# EAGLE design panel2 (EAGLE 7.7.0)
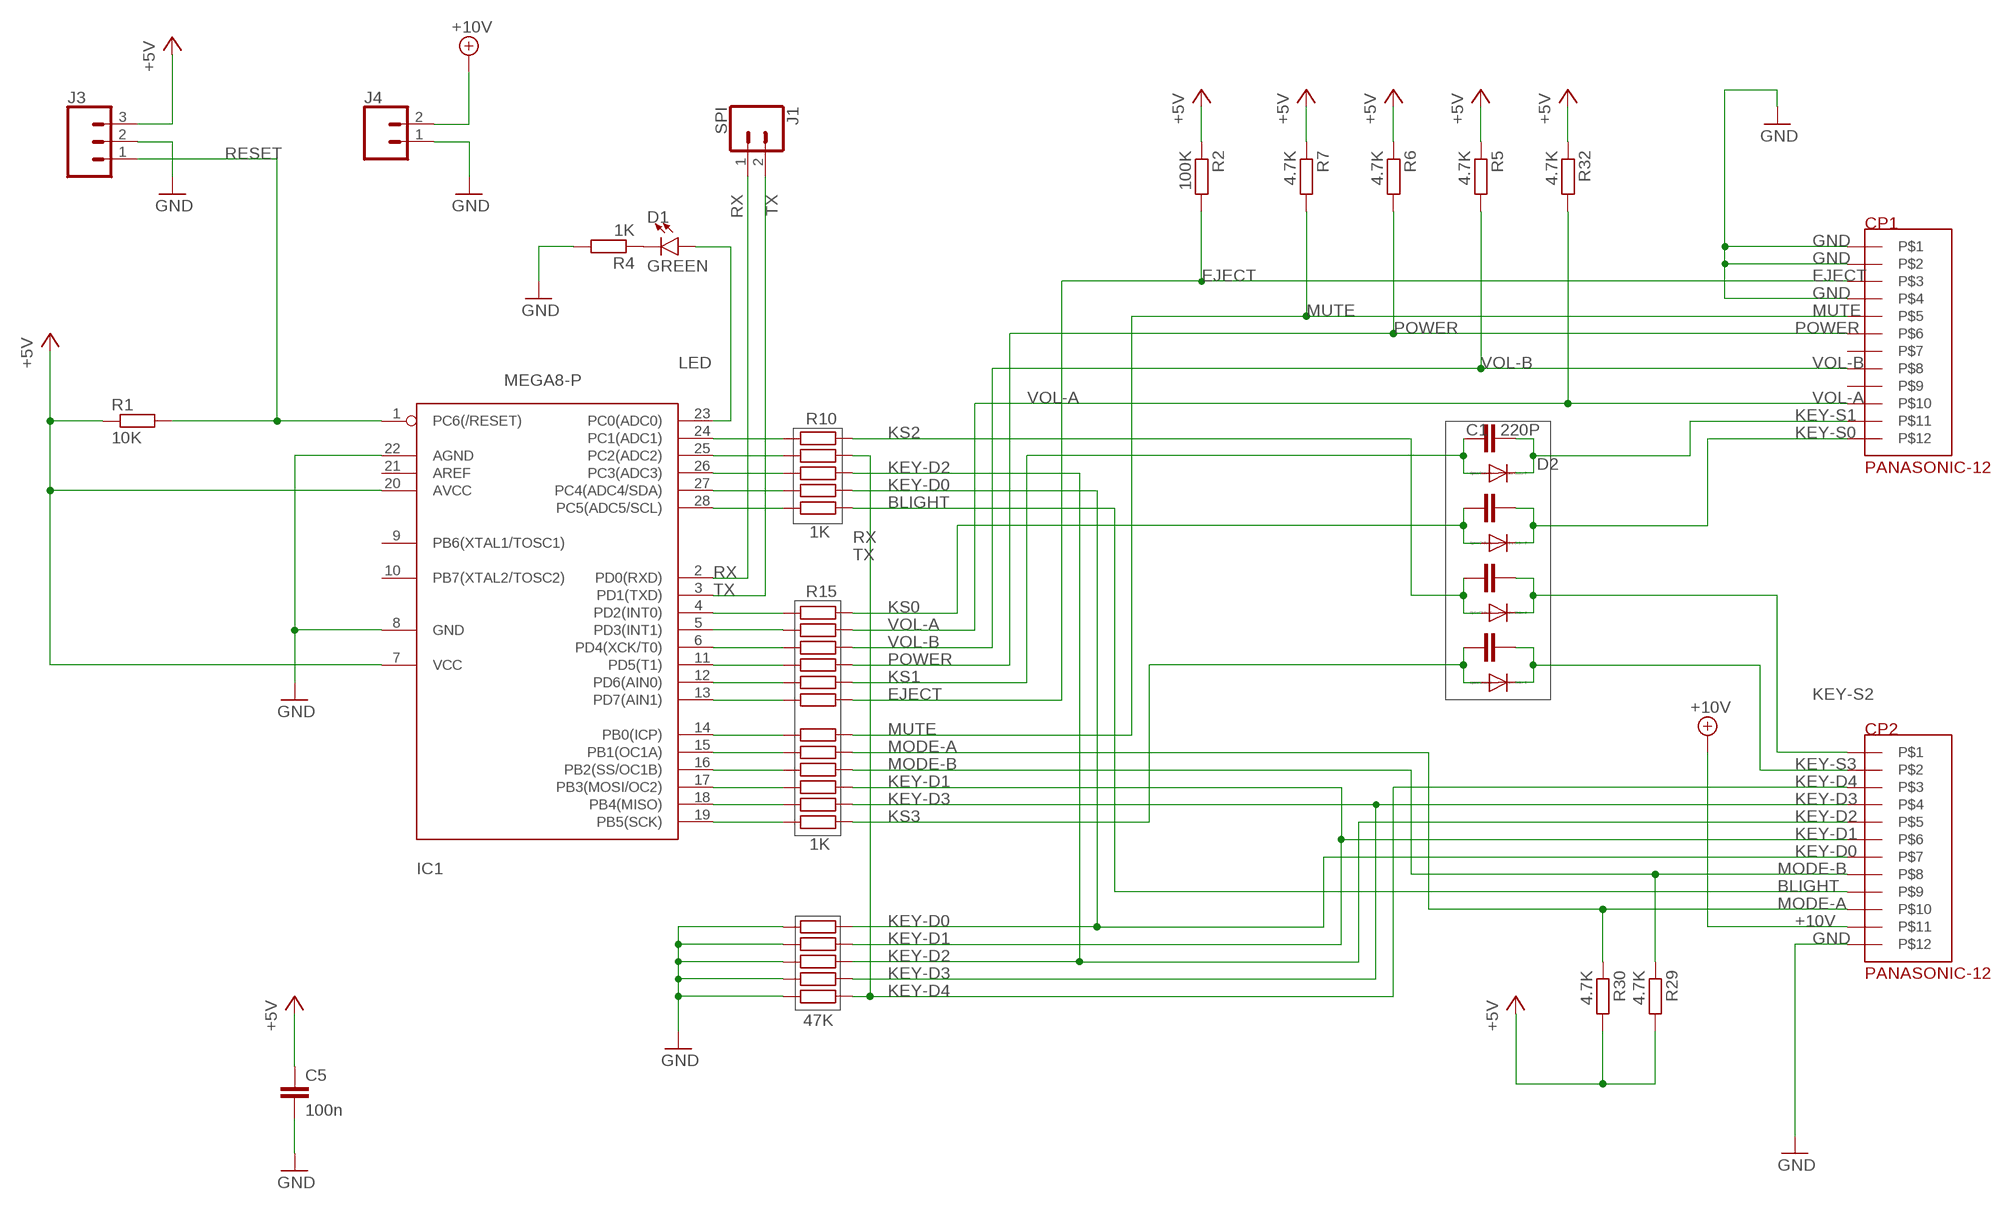
[diagram p0: schematic, sheet 1]

## Parts
C1  220P  C-EUC0805  [C0805]
C2  220P  C-EUC0805  [C0805]
C3  220P  C-EUC0805  [C0805]
C4  220P  C-EUC0805  [C0805]
C5  100n  C-EUC0805  [C0805]
CP1  PANASONIC-12  [PANASONIC-12]
CP2  PANASONIC-12  [PANASONIC-12]
D1  GREEN  LED-GREEN1206  [LED-1206]
D2  1N4148DO35-10  [DO35-10]
D3  1N4148DO35-10  [DO35-10]
D4  1N4148DO35-10  [DO35-10]
D5  1N4148DO35-10  [DO35-10]
IC1  MEGA8-P  [DIL28-3]
J1  SPI  CONN_02PTH3  [1X02_LONGPADS]
J3  CONN_03LONGPADS  [1X03_LONGPADS]
J4  CONN_02LOCK_LONGPADS  [1X02_LOCK_LONGPADS]
R1  10K  R-EU_M0805  [M0805]
R2  100K  R-EU_M0805  [M0805]
R3  47K  R-EU_0207/10  [0207/10]
R4  1K  R-EU_M0805  [M0805]
R5  4.7K  R-EU_M0805  [M0805]
R6  4.7K  R-EU_M0805  [M0805]
R7  4.7K  R-EU_M0805  [M0805]
R8  1K  R-EU_M0805  [M0805]
R9  1K  R-EU_M0805  [M0805]
R10  1K  R-EU_M0805  [M0805]
R11  1K  R-EU_M0805  [M0805]
R12  1K  R-EU_M0805  [M0805]
R13  1K  R-EU_M0805  [M0805]
R14  1K  R-EU_M0805  [M0805]
R15  1K  R-EU_M0805  [M0805]
R16  1K  R-EU_M0805  [M0805]
R17  1K  R-EU_M0805  [M0805]
R18  1K  R-EU_M0805  [M0805]
R19  1K  R-EU_M0805  [M0805]
R20  1K  R-EU_M0805  [M0805]
R21  1K  R-EU_M0805  [M0805]
R22  1K  R-EU_M0805  [M0805]
R23  1K  R-EU_M0805  [M0805]
R24  47K  R-EU_0207/10  [0207/10]
R25  47K  R-EU_0207/10  [0207/10]
R28  47K  R-EU_0207/10  [0207/10]
R29  4.7K  R-EU_M0805  [M0805]
R30  4.7K  R-EU_M0805  [M0805]
R31  1K  R-EU_M0805  [M0805]
R32  4.7K  R-EU_0207/10  [0207/10]
R34  47K  R-EU_0207/10  [0207/10]

## Nets
+5V: C5.1 IC1.7(VCC) IC1.20(AVCC) J3.3 R1.1 R2.1 R5.1 R6.1 R7.1 R29.2 R30.2 R32.1
+10V: CP2.P11 J4.2
BLIGHT: CP2.P9 R14.2
EJECT: CP1.P3 R2.2 R23.2
GND: C5.2 CP1.P1 CP1.P2 CP1.P4 CP2.P12 IC1.8(GND) IC1.22(AGND) J3.2 J4.1 R3.2 R4.2 R24.2 R25.2 R28.2 R34.2
KEY-D0: CP2.P7 R13.2 R24.1
KEY-D1: CP2.P6 R18.2 R25.1
KEY-D2: CP2.P5 R12.2 R28.1
KEY-D3: CP2.P4 R21.2 R34.1
KEY-D4: CP2.P3 R3.1 R11.2
KEY-S0: C2.2 CP1.P12 D3.C
KEY-S1: C1.2 CP1.P11 D2.C
KEY-S2: C3.2 CP2.P1 D4.C
KEY-S3: C4.2 CP2.P2 D5.C
KS0: C2.1 D3.A R15.2
KS1: C1.1 D2.A R22.2
KS2: C3.1 D4.A R10.2
KS3: C4.1 D5.A R31.2
LED: D1.A IC1.23(PC0(ADC0))
MODE-A: CP2.P10 R20.2 R30.1
MODE-B: CP2.P8 R17.2 R29.1
MUTE: CP1.P5 R7.2 R19.2
N$3: D1.C R4.1
N$4: IC1.4(PD2(INT0)) R15.1
N$5: IC1.24(PC1(ADC1)) R10.1
N$6: IC1.25(PC2(ADC2)) R11.1
N$7: IC1.26(PC3(ADC3)) R12.1
N$8: IC1.27(PC4(ADC4/SDA)) R13.1
N$9: IC1.28(PC5(ADC5/SCL)) R14.1
N$10: IC1.5(PD3(INT1)) R16.1
N$11: IC1.6(PD4(XCK/T0)) R8.1
N$12: IC1.11(PD5(T1)) R9.1
N$19: IC1.19(PB5(SCK)) R31.1
N$20: IC1.18(PB4(MISO)) R21.1
N$21: IC1.17(PB3(MOSI/OC2)) R18.1
N$22: IC1.16(PB2(SS/OC1B)) R17.1
N$23: IC1.15(PB1(OC1A)) R20.1
N$24: IC1.14(PB0(ICP)) R19.1
N$25: IC1.12(PD6(AIN0)) R22.1
N$26: IC1.13(PD7(AIN1)) R23.1
POWER: CP1.P6 R6.2 R9.2
RESET: IC1.1(PC6(/RESET)) J3.1 R1.2
RX: IC1.2(PD0(RXD)) J1.1
TX: IC1.3(PD1(TXD)) J1.2
VOL-A: CP1.P10 R16.2 R32.2
VOL-B: CP1.P8 R5.2 R8.2
Unconnected: CP1.P7 CP1.P9 IC1.9(PB6(XTAL1/TOSC1)) IC1.10(PB7(XTAL2/TOSC2)) IC1.21(AREF)

## Library data of the parts
C1-C5 = rcl:C-EU: CAPACITOR, European symbol
CP1 CP2 = Connectors:PANASONIC-12
D1 = SparkFun-LED:LED-GREEN: Green SMD LED Used in manufacturing of various products at SparkFun Packages: 0603 - SMD 0603 package [Product Link] <http://www.futureelectronics.com/en/technologies/semiconductors/optoelectronics/leds/Pages/9894312-LTST-C190GKT.aspx?CrossPart=HSMG-C190&IM=0> LilyPad 1206 - SMD1206 LilyPad package [Product Link] <http://www.futureelectronics.com/en/Technologies/Product.aspx?ProductID=IN150NGHARVATEKCORPORATION2049943&IM=0> 1206 - SMD1206 package [Product Link] <http://www.futureelectronics.com/en/technologies/semiconductors/optoelectronics/leds/Pages/8315665-LTST-C150KGKT.aspx?IM=0> 1206 Bottom Mount -SMD 1206 Bottom Mount [Product Link] <http://www.digikey.com/product-detail/en/lite-on-inc/LTST-C230KGKT/160-1456-1-ND/386854> SparkFun Products: Pro Mini 328 -5V <https://www.sparkfun.com/products/821> RedBoard <https://www.sparkfun.com/products/12757> MP3 Trigger <https://www.sparkfun.com/products/13720> Makey Makey <https://www.sparkfun.com/products/11076>; PROD_ID: DIO-00862
D2-D5 = diode:1N4148: DIODE high speed (Philips)
IC1 = avr:MEGA8-P: MICROCONTROLLER 8 Kbytes FLASH 1 kbytes SRAM 512 bytes EEPROM USART 4-channel 10 bit ADC 2-channel 8 bit ADC
J1 J4 = SparkFun-Connectors:CONN_02: Multi connection point. Often used as Generic Header-pin footprint for 0.1 inch spaced/style header connections On any of the 0.1 inch spaced packages, you can populate with these: Break Away Headers - Straight <https://www.sparkfun.com/products/116> (PRT-00116) Break Away Male Headers - Right Angle <https://www.sparkfun.com/products/553> (PRT-00553) Female Headers <https://www.sparkfun.com/products/115> (PRT-00115) Break Away Headers - Machine Pin <https://www.sparkfun.com/products/117> (PRT-00117) Break Away Female Headers - Swiss Machine Pin <https://www.sparkfun.com/products/743> (PRT-00743) For SCREWTERMINALS and SPRING TERMINALS visit here: Screw Terimnals on SparkFun.com <https://www.sparkfun.com/search/results?term=Screw+Terminals> (5mm/3.5mm/2.54mm spacing) This device is also useful as a general connection point to wire up your design to another part of your project. Our various solder wires solder well into these plated through hole pads. Hook-Up Wire - Assortment (Stranded, 22 AWG) <https://www.sparkfun.com/products/11375> (PRT-11375) Hook-Up Wire - Assortment (Solid Core, 22 AWG) <https://www.sparkfun.com/products/11367> (PRT-11367) View the entire wire category on our website here <https://www.sparkfun.com/categories/141> Special notes: Molex polarized connector foot print use with: PRT-08233 with associated crimp pins and housings. 2.54_SCREWTERM for use with PRT-10571. 3.5mm Screw Terminal footprints for PRT-08084 5mm Screw Terminal footprints for use with PRT-08432
J3 = SparkFun-Connectors:CONN_03: Multi connection point. Often used as Generic Header-pin footprint for 0.1 inch spaced/style header connections On any of the 0.1 inch spaced packages, you can populate with these: Break Away Headers - Straight <https://www.sparkfun.com/products/116> (PRT-00116) Break Away Male Headers - Right Angle <https://www.sparkfun.com/products/553> (PRT-00553) Female Headers <https://www.sparkfun.com/products/115> (PRT-00115) Break Away Headers - Machine Pin <https://www.sparkfun.com/products/117> (PRT-00117) Break Away Female Headers - Swiss Machine Pin <https://www.sparkfun.com/products/743> (PRT-00743) Stackable Header - 3 Pin (Female, 0.1") <https://www.sparkfun.com/products/13875> (PRT-13875) For SCREWTERMINALS and SPRING TERMINALS visit here: Screw Terimnals on SparkFun.com <https://www.sparkfun.com/search/results?term=Screw+Terminals> (5mm/3.5mm/2.54mm spacing) This device is also useful as a general connection point to wire up your design to another part of your project. Our various solder wires solder well into these plated through hole pads. Hook-Up Wire - Assortment (Stranded, 22 AWG) <https://www.sparkfun.com/products/11375> (PRT-11375) Hook-Up Wire - Assortment (Solid Core, 22 AWG) <https://www.sparkfun.com/products/11367> (PRT-11367) View the entire wire category on our website here <https://www.sparkfun.com/categories/141> Special notes: Molex polarized connector foot print use with SKU : PRT-08232 with associated crimp pins and housings.
R1-R25 R28-R32 R34 = rcl:R-EU_: RESISTOR, European symbol

## Board
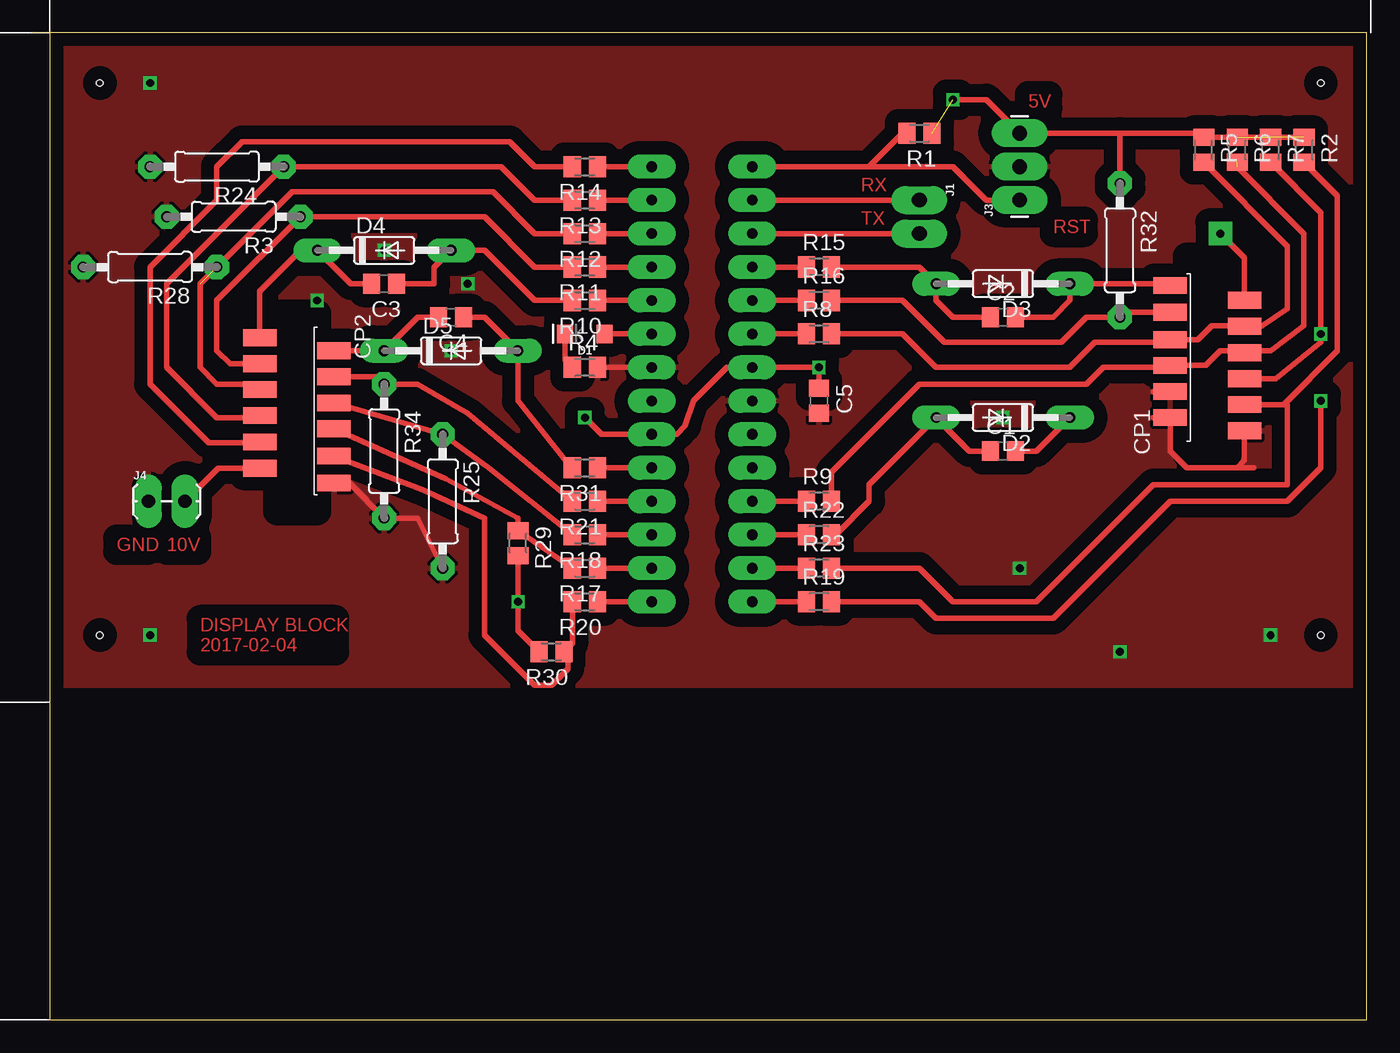
[diagram p1: board, top side]
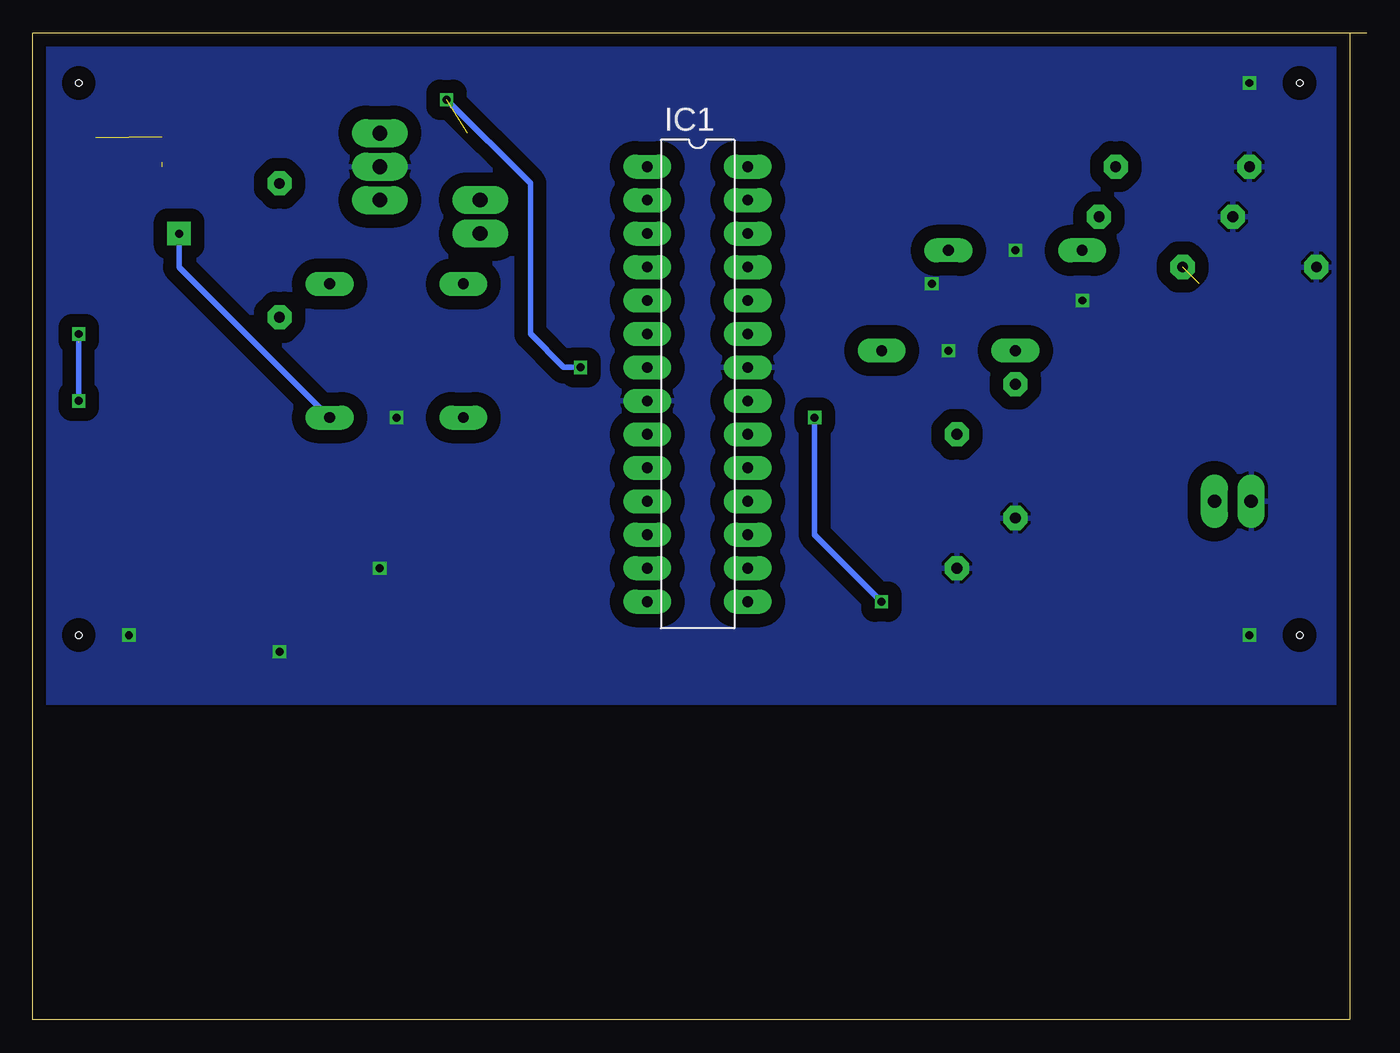
[diagram p2: board, bottom side, seen from below]

Size 101.27 x 74.92 mm. Coordinates in mm from the lower left corner, seen from the top.
Outline: 1.27,74.92 1.27,0 101.27,0 101.27,74.92 1.27,74.92
Outline: 1.27,74.92 0,74.92
Copper layers (1*16): Top 0.035mm / dielectric 1.5mm / Bottom 0.035mm
Design rules "default *": minimum track width 12mil, minimum drill 12mil, track to track 12mil, track to pad 12mil, pad to pad 12mil, via to via 12mil, smd to smd 8mil, copper to edge 40mil, drill to drill 40mil, minimum pad ring 20mil, minimum via ring 8mil, stop-mask expansion 4mil, vias tented up to drill 0mil, thermal gap 10mil
Holes 0.5 mm at 97.79,71.12 5.08,29.21 97.79,29.21 5.08,71.12

### Footprints (pad centres in the part's own frame; a part is rotated, then mirrored left to right if it is on the bottom)
C0805 = smd 1.3 x 1.5: 1 -0.95,0; 2 0.95,0
PANASONIC-12 = smd 1.27 x 2.54: P1 -0.991,-4.369; P2 0,1.27; P3 0.991,-4.369; P4 1.981,1.27; P5 2.946,-4.369; P6 3.962,1.27; P7 4.928,-4.369; P8 5.918,1.27; P9 6.934,-4.369; P10 8.001,1.27; P11 8.915,-4.369; P12 10.033,1.27
LED-1206 = smd 1.2 x 1.4: A -1.5,0; C 1.5,0
DO35-10 = drill 0.813 long: A 5.08,0; C -5.08,0
DIL28-3 = drill 0.813 long: 1 -16.51,-3.81; 2 -13.97,-3.81; 3 -11.43,-3.81; 4 -8.89,-3.81; 5 -6.35,-3.81; 6 -3.81,-3.81; 7 -1.27,-3.81; 8 1.27,-3.81; 9 3.81,-3.81; 10 6.35,-3.81; 11 8.89,-3.81; 12 11.43,-3.81; 13 13.97,-3.81; 14 16.51,-3.81; 15 16.51,3.81; 16 13.97,3.81; 17 11.43,3.81; 18 8.89,3.81; 19 6.35,3.81; 20 3.81,3.81; 21 1.27,3.81; 22 -1.27,3.81; 23 -3.81,3.81; 24 -6.35,3.81; 25 -8.89,3.81; 26 -11.43,3.81; 27 -13.97,3.81; 28 -16.51,3.81
1X02_LONGPADS = drill 1.118 pad 1.88 long: 1 0,0; 2 2.54,0
1X03_LONGPADS = drill 1.118 pad 1.88 long: 1 0,0; 2 2.54,0; 3 5.08,0
1X02_LOCK_LONGPADS = drill 1.016 long: 1 -0.127,0; 2 2.667,0
M0805 = smd 1.3 x 1.6: 1 -0.95,0; 2 0.95,0
0207/10 = drill 0.813 octagon: 1 -5.08,0; 2 5.08,0

### Placement (x,y rotation side)
C1  73.66,43.18 0 top
C2  73.66,53.34 0 top
C3  26.67,55.88 180 top
C4  31.75,53.34 180 top
C5  59.69,46.99 270 top
CP1  87.63,45.72 90 top
CP2  21.59,50.8 270 top
D1  41.91,52.07 180 top
D2  73.66,45.72 180 top
D3  73.66,55.88 180 top
D4  26.67,58.42 0 top
D5  31.75,50.8 0 top
IC1  50.8,48.26 270 bottom
J1  67.31,62.23 270 top
J3  74.93,62.23 90 top
J4  8.89,39.37 0 top
R1  67.31,67.31 180 top
R2  96.52,66.04 270 top
R3  15.24,60.96 180 top
R4  41.91,49.53 0 top
R5  88.9,66.04 270 top
R6  91.44,66.04 270 top
R7  93.98,66.04 270 top
R8  59.69,52.07 0 top
R9  59.69,39.37 0 top
R10  41.91,54.61 180 top
R11  41.91,57.15 180 top
R12  41.91,59.69 180 top
R13  41.91,62.23 180 top
R14  41.91,64.77 180 top
R15  59.69,57.15 0 top
R16  59.69,54.61 0 top
R17  41.91,34.29 180 top
R18  41.91,36.83 180 top
R19  59.69,31.75 0 top
R20  41.91,31.75 180 top
R21  41.91,39.37 180 top
R22  59.69,36.83 0 top
R23  59.69,34.29 0 top
R24  13.97,64.77 180 top
R25  31.11,39.37 270 top
R28  8.89,57.15 180 top
R29  36.83,36.2 270 top
R30  39.37,27.94 180 top
R31  41.91,41.91 180 top
R32  82.55,58.42 270 top
R34  26.67,43.18 270 top

### Tracks (layer width: path | path; a pad name or v marks a point on that pad's centre or on a via)
+5V  (via drill 0.6)  (3 unrouted)
  Top 0.406: 82.55,67.31 88.58,67.31 R5.1 R2.1 | R32.1 82.55,67.31 | C5.1 v59.69,49.53 IC1.7 52.71,49.53 50.17,46.99 49.53,45.09 48.9,44.45 IC1.20 43.18,44.45 v41.91,45.72 | 82.55,67.31 J3.3 72.39,69.85 v69.85,69.85 | R29.2 v36.83,31.75 36.83,29.53 R30.2
  Bottom 0.406: v69.85,69.85 63.5,63.5 63.5,52.07 60.96,49.53 v59.69,49.53 | v41.91,45.72 41.91,36.83 v36.83,31.75
+10V
  Top 0.406: CP2.P11 14.07,41.89 J4.2
BLIGHT
  Top 0.406: CP2.P9 17.17,43.82 13.33,43.82 8.89,48.26 8.89,57.15 13.97,62.23 13.97,64.77 15.88,66.67 36.2,66.67 38.1,64.77 R14.2
EJECT
  Top 0.406: R2.2 99.06,62.55 99.06,50.8 94.97,46.71 CP1.P3 95.25,46.71 95.25,40.64 85.09,40.64 76.2,31.75 69.85,31.75 67.31,34.29 R23.2
GND  (via drill 0.6)
  Top 0.406: CP1.P4 85.09,47.7 | 85.09,45.72 CP1.P2 86.36,43.18 87.63,41.91 91.44,41.91 | R4.2 IC1.22 | R25.2 29.21,38.1 R34.2 24,40.77 CP2.P12 | 91.44,41.91 92.71,41.91 | CP1.P1 92,42.47 91.44,41.91
  other vias: 74.93,34.29 82.55,27.94 21.59,54.61 33.02,55.88 31.75,50.8 26.67,58.42 73.66,45.72 8.89,71.12 8.89,29.21 93.98,29.21
  pour Top (isolate 1.016): 1.27,74.93 1.27,25.4 101.6,25.4 101.6,74.93
  pour Bottom (isolate 1.016): 1.27,74.93 101.6,74.93 101.6,24.13 1.27,24.13
KEY-D0
  Top 0.406: R13.2 38.1,62.23 35.56,64.77 R24.1 10.16,55.88 10.16,49.53 13.97,45.72 17.07,45.72 CP2.P7
KEY-D1
  Top 0.406: R18.2 34.61,41.91 R25.1 CP2.P6
KEY-D2  (1 unrouted)
  Top 0.406: R12.2 38.1,59.69 34.93,62.86 19.68,62.86 12.7,55.88 12.7,49.53 13.97,48.26 16.82,48.26 CP2.P5
KEY-D3
  Top 0.406: CP2.P4 26.11,48.82 R34.1 29.21,48.26 33.02,46.04 R21.2
KEY-D4
  Top 0.406: CP2.P3 14.96,49.81 13.97,50.8 13.97,54.61 R3.1 34.29,60.96 38.1,57.15 R11.2
KEY-S0
  Top 0.406: C2.2 77.47,53.34 78.74,54.61 D3.C 86.23,55.88 CP1.P12
KEY-S1  (via drill 0.6 pad 1.78)
  Top 0.406: C1.2 76.2,43.18 D2.C | CP1.P11 92,57.86 v90.17,59.69
  Bottom 0.406: v90.17,59.69 90.17,57.15 D2.C
KEY-S2
  Top 0.406: CP2.P1 17.22,55.32 20.32,58.42 D4.C 24.13,55.88 C3.2
KEY-S3
  Top 0.406: CP2.P2 D5.C 29.21,53.34 C4.2
KS0
  Top 0.406: R15.2 67.31,57.15 D3.A 68.58,54.61 69.85,53.34 C2.1
KS1
  Top 0.406: C1.1 71.12,43.18 D2.A 63.5,40.64 63.5,39.37 60.96,36.83 R22.2
KS2
  Top 0.406: R10.2 38.1,54.61 34.29,58.42 D4.A 30.48,57.15 30.48,55.88 C3.1
KS3
  Top 0.406: C4.1 34.29,53.34 D5.A 36.83,46.99 40.64,42.23 R31.2
LED
  Top 0.406: IC1.23 D1.A
MODE-A
  Top 0.406: CP2.P10 29.59,40.26 34.29,38.1 34.29,29.21 38.1,25.4 39.37,25.4 40.64,26.67 40.64,27.62 R30.1 40.96,28.58 R20.2
MODE-B
  Top 0.406: CP2.P8 31.32,41.07 36.83,38.1 R29.1 R17.2 40.64,34.61
MUTE  (via drill 0.6)  (1 unrouted)
  Top 0.406: CP1.P5 94.39,48.67 97.79,51.44 v97.79,52.07 97.79,61.28 R7.2 | R19.2 67.31,31.75 68.58,30.48 77.47,30.48 86.36,39.37 95.25,39.37 97.79,41.91 v97.79,46.99
  Bottom 0.406: v97.79,46.99 97.79,51.49
N$3
  Top 0.406: D1.C 40.41,50.08 R4.1
N$4
  Top 0.406: IC1.4 R15.1
N$5
  Top 0.406: IC1.24 R10.1
N$6
  Top 0.406: IC1.25 R11.1
N$7
  Top 0.406: IC1.26 R12.1
N$8
  Top 0.406: IC1.27 R13.1
N$9
  Top 0.406: IC1.28 R14.1
N$10
  Top 0.406: IC1.5 R16.1
N$11
  Top 0.406: IC1.6 R8.1
N$12
  Top 0.406: IC1.11 R9.1
N$19
  Top 0.406: IC1.19 R31.1
N$20
  Top 0.406: IC1.18 R21.1
N$21
  Top 0.406: IC1.17 R18.1
N$22
  Top 0.406: IC1.16 R17.1
N$23
  Top 0.406: R20.1 IC1.15
N$24
  Top 0.406: IC1.14 R19.1
N$25
  Top 0.406: IC1.12 R22.1
N$26
  Top 0.406: IC1.13 R23.1
POWER  (1 unrouted)
  Top 0.406: R9.2 60.64,41.59 67.31,48.26 80.01,48.26 81.28,49.53 86.21,49.53 CP1.P6 89.05,49.68 90.17,50.8 93.98,50.8 96.52,52.7 96.52,59.69 91.44,64.77
RESET
  Top 0.406: 63.5,64.77 69.85,64.77 72.39,62.23 J3.1 | 63.5,64.77 IC1.1 | R1.2 66.04,67.31 63.5,64.77
RX
  Top 0.406: IC1.2 J1.1
TX
  Top 0.406: J1.2 IC1.3
VOL-A
  Top 0.406: CP1.P10 82.93,53.72 R32.2 80.01,53.34 78.1,51.44 69.21,51.44 66.04,54.61 R16.2
VOL-B
  Top 0.406: R8.2 66.04,52.07 68.58,49.53 78.74,49.53 80.64,51.44 86.16,51.44 CP1.P8 88.47,51.64 89.53,52.7 93.34,52.7 95.25,53.98 95.25,58.74 R5.2

### Text on the board
Top: 5V | RX | TX | RST | GND | 10V | DISPLAY BLOCK / 2017-02-04